# Altium schematic sheet AC-DC_Box_AssemblyInstructions_240V.SchDoc
size Tabloid; DocumentNumber: 1; SheetNumber: 1; SheetTotal: 11; Pagesize: Tabloide
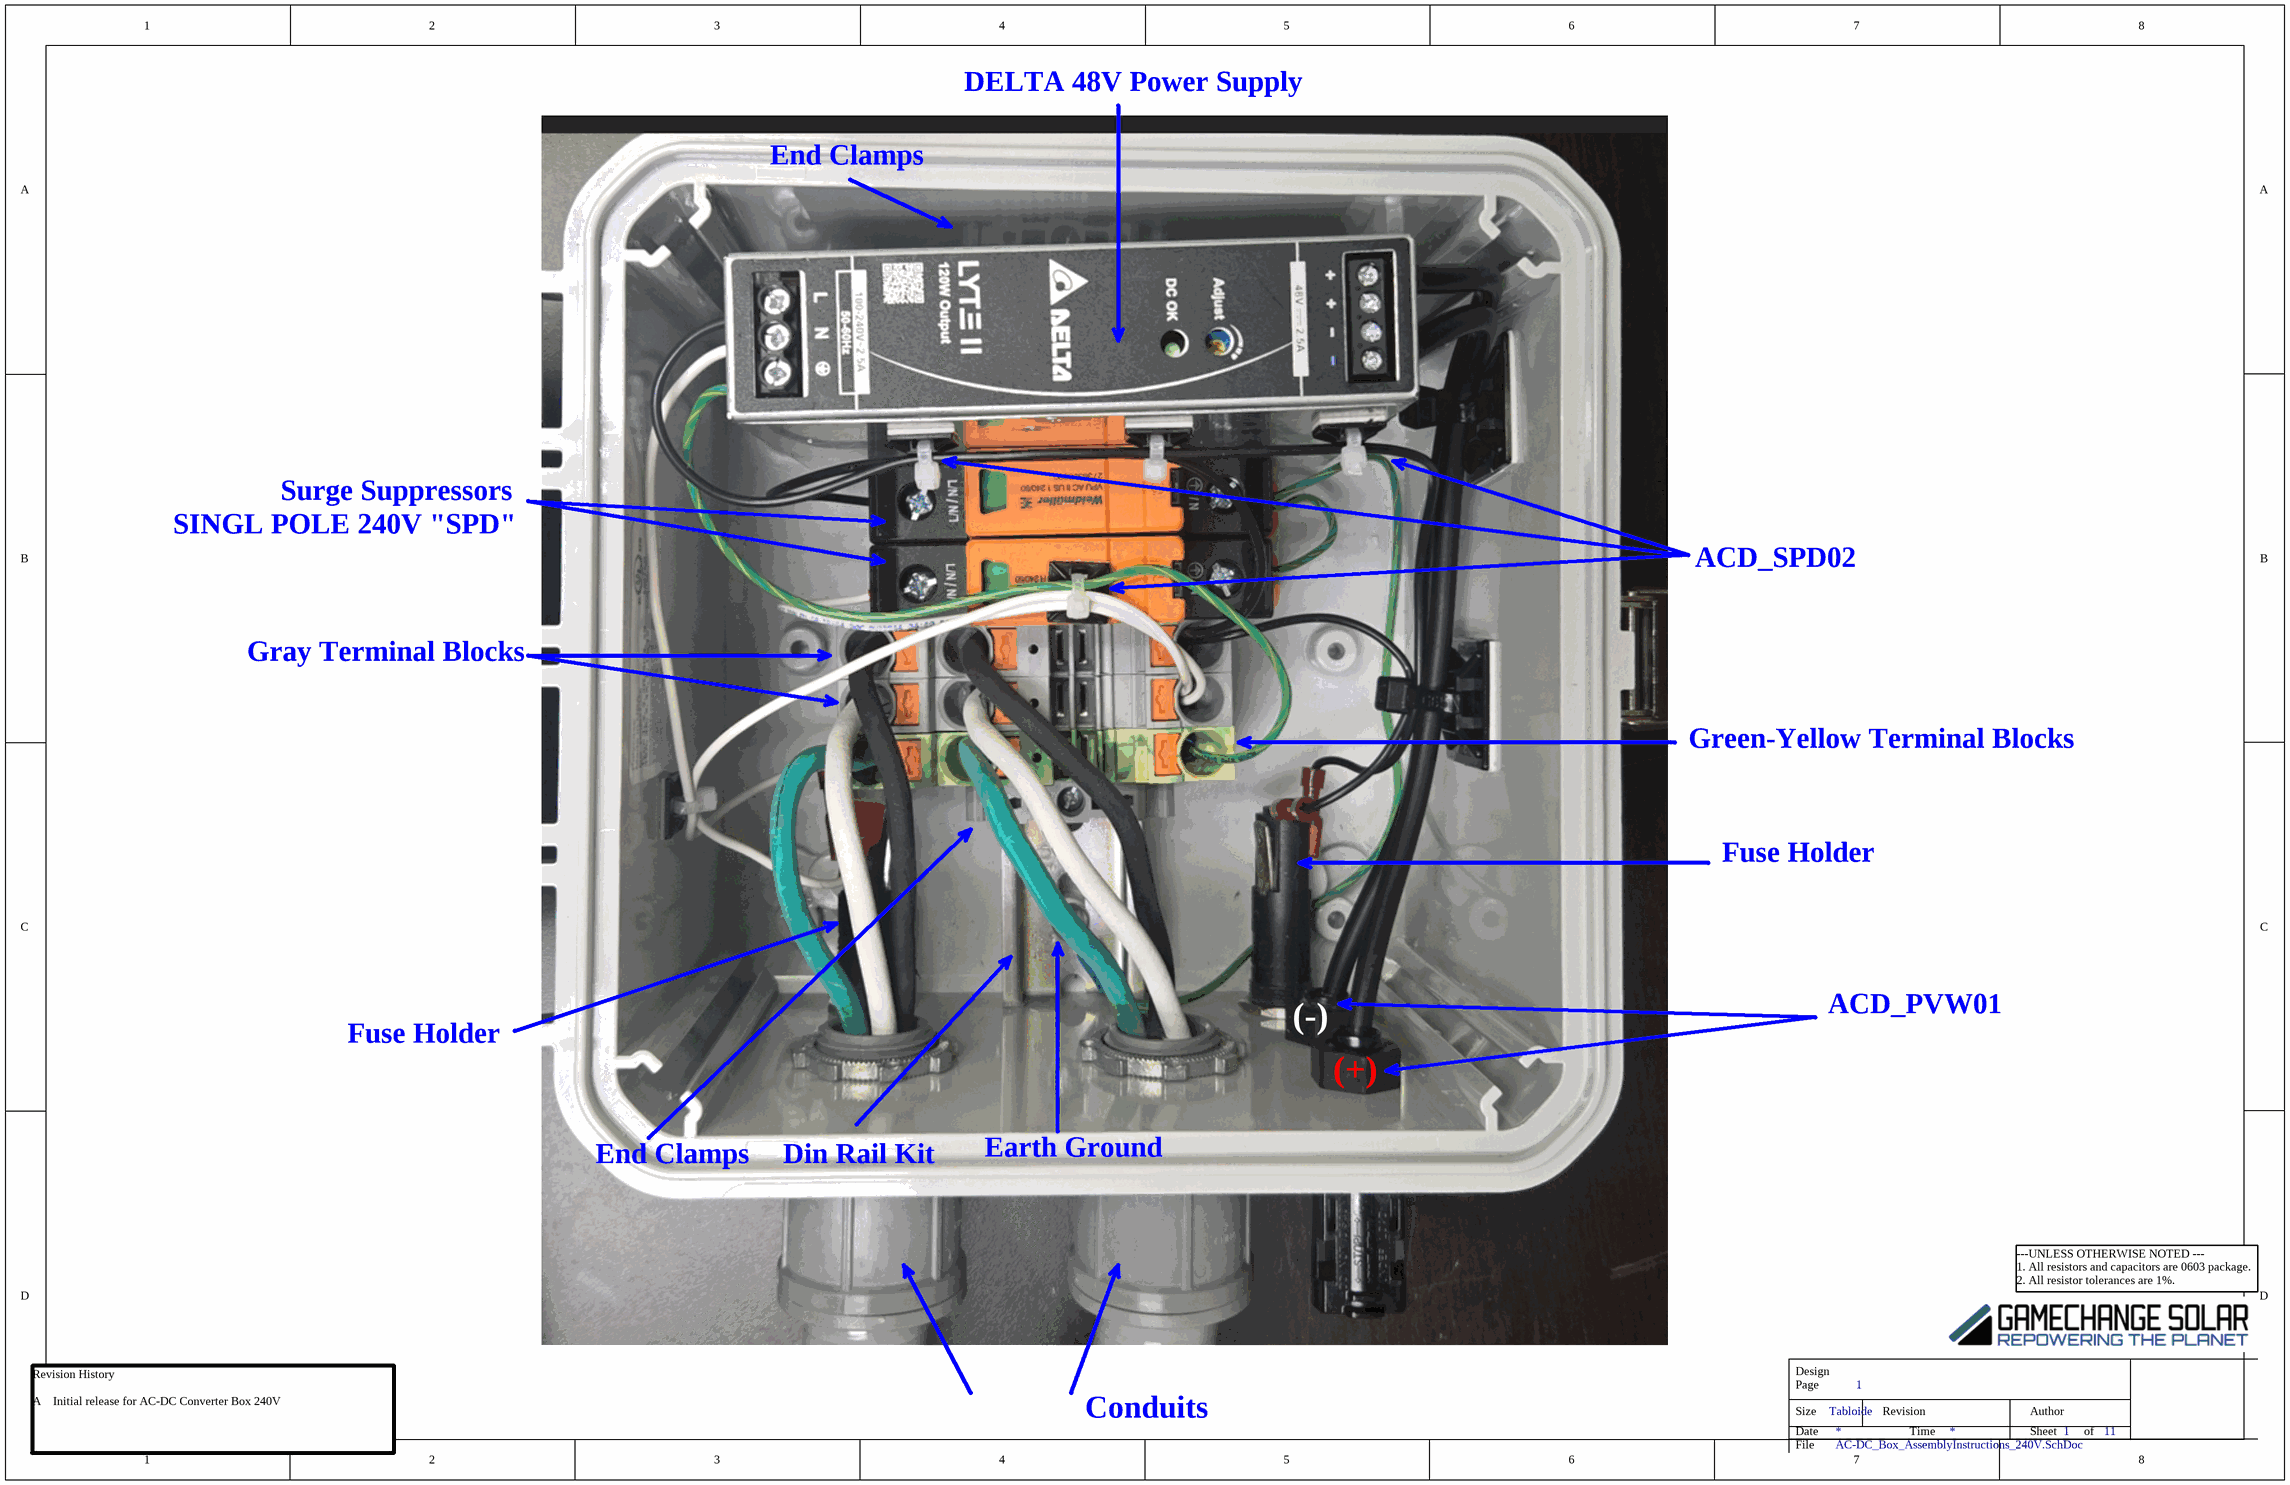
[diagram p0: AC-DC_Box_AssemblyInstructions_240V.SchDoc]

## Notes on the sheet
- DELTA 48V Power Supply
- End Clamps
- SINGL POLE 240V "SPD"
- Surge Suppressors
- ACD_SPD02
- Gray Terminal Blocks
- Green-Yellow Terminal Blocks
- Fuse Holder
- (-)
- ACD_PVW01
- (+)
- Din Rail Kit
- Earth Ground
- Conduits
- Revision History
  A    Initial release for AC-DC Converter Box 240V
- ---UNLESS OTHERWISE NOTED ---
  1. All resistors and capacitors are 0603 package.
  2. All resistor tolerances are 1%.
- Design
- Size
- Date
- Page
- Revision
- Time
- Sheet
- Author
- of
- File